# EAGLE design Preamplifier (EAGLE 9.5.1)
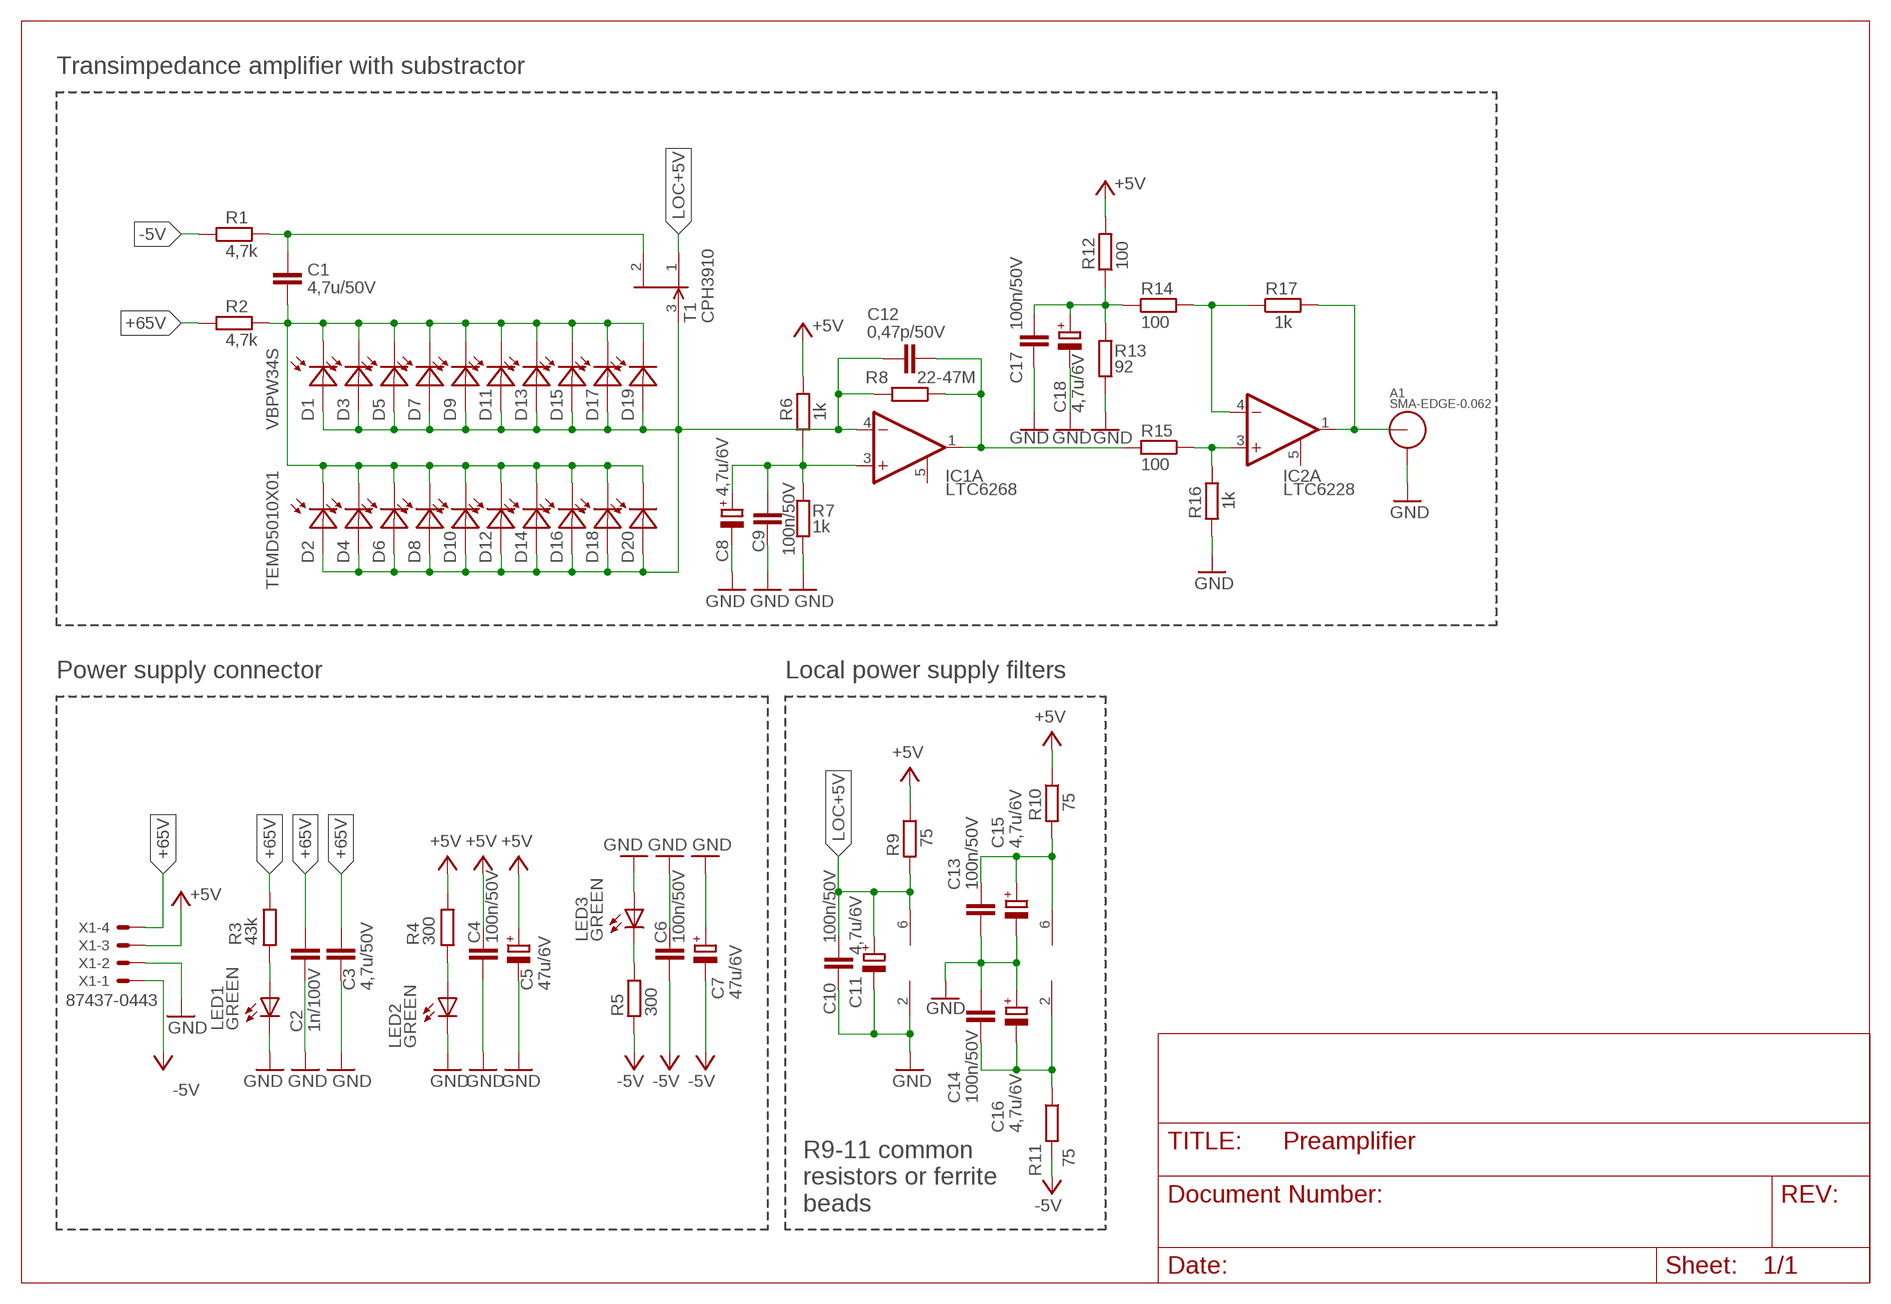
[diagram p0: schematic, sheet 1]

## Parts
A1  SMA-EDGE-0.062  LINX-SMA-EDGE-0.062  [CONSMA003.062]
C1  4,7u/50V  C-EUC1206  [C1206]
C2  1n/100V  C-EUC0603  [C0603]
C3  4,7u/50V  C-EUC1206  [C1206]
C4  100n/50V  C-EUC0603  [C0603]
C5  47u/6V  CPOL-EUSMCB  [SMC_B]
C6  100n/50V  C-EUC0603  [C0603]
C7  47u/6V  CPOL-EUSMCB  [SMC_B]
C8  4,7u/6V  CPOL-EUSMCA  [SMC_A]
C9  100n/50V  C-EUC0603  [C0603]
C10  100n/50V  C-EUC0603  [C0603]
C11  4,7u/6V  CPOL-EUSMCA  [SMC_A]
C12  0,47p/50V  C-EUC0603  [C0603]
C13  100n/50V  C-EUC0603  [C0603]
C14  100n/50V  C-EUC0603  [C0603]
C15  4,7u/6V  CPOL-EUSMCA  [SMC_A]
C16  4,7u/6V  CPOL-EUSMCA  [SMC_A]
C17  100n/50V  C-EUC0603  [C0603]
C18  4,7u/6V  CPOL-EUSMCA  [SMC_A]
D1  VBPW34S  [SOD6439X130N]
D2  TEMD5010X01  [DIODE_TEMD5010]
D3  VBPW34S  [SOD6439X130N]
D4  TEMD5010X01  [DIODE_TEMD5010]
D5  VBPW34S  [SOD6439X130N]
D6  TEMD5010X01  [DIODE_TEMD5010]
D7  VBPW34S  [SOD6439X130N]
D8  TEMD5010X01  [DIODE_TEMD5010]
D9  VBPW34S  [SOD6439X130N]
D10  TEMD5010X01  [DIODE_TEMD5010]
D11  VBPW34S  [SOD6439X130N]
D12  TEMD5010X01  [DIODE_TEMD5010]
D13  VBPW34S  [SOD6439X130N]
D14  TEMD5010X01  [DIODE_TEMD5010]
D15  VBPW34S  [SOD6439X130N]
D16  TEMD5010X01  [DIODE_TEMD5010]
D17  VBPW34S  [SOD6439X130N]
D18  TEMD5010X01  [DIODE_TEMD5010]
D19  VBPW34S  [SOD6439X130N]
D20  TEMD5010X01  [DIODE_TEMD5010]
IC1  LTC6268  [TSOT23-6]
IC2  LTC6228  LTC6268  [TSOT23-6]
LED1  GREEN  LEDCHIPLED_0603  [CHIPLED_0603]
LED2  GREEN  LEDCHIPLED_0603  [CHIPLED_0603]
LED3  GREEN  LEDCHIPLED_0603  [CHIPLED_0603]
R1  4,7k  R-EU_R0603  [R0603]
R2  4,7k  R-EU_R0603  [R0603]
R3  43k  R-EU_R0603  [R0603]
R4  300  R-EU_R0603  [R0603]
R5  300  R-EU_R0603  [R0603]
R6  1k  R-EU_R0603  [R0603]
R7  1k  R-EU_R0603  [R0603]
R8  22-47M  R-EU_R0603  [R0603]
R9  75  R-EU_R0603  [R0603]
R10  75  R-EU_R0603  [R0603]
R11  75  R-EU_R0603  [R0603]
R12  100  R-EU_R0603  [R0603]
R13  92  R-EU_R0603  [R0603]
R14  100  R-EU_R0603  [R0603]
R15  100  R-EU_R0603  [R0603]
R16  1k  R-EU_R0603  [R0603]
R17  1k  R-EU_R0603  [R0603]
T1  CPH3910  [SOT23]
X1  87437-0443  87438-0487437-0443  [87437-0443]

## Nets
+5V: C4.2 C5.+ R4.2 R6.2 R9.1 R10.1 R12.2 X1.3 X1.7
+65V: C2.2 C3.1 R2.1 R3.2 X1.4 X1.8
-5V: C6.1 C7.- R1.1 R5.1 R11.2 X1.1 X1.5
GND: A1.GND1 A1.GND2 A1.GND3 A1.GND4 C2.1 C3.2 C4.1 C5.- C6.2 C7.+ C8.- C9.1 C10.1 C11.- C13.1 C14.2 C15.- C16.+ C17.2 C18.- IC1.2(P:GND) LED1.C LED2.C LED3.A R7.1 R13.1 R16.2 X1.2 X1.6
LOC+5V: C10.2 C11.+ IC1.6(P:VDD) R9.2 T1.1(S)
N$1: IC2.3(A:+IN) R15.1 R16.1
N$2: C1.2 R1.2 T1.2(D)
N$3: C8.+ C9.2 IC1.3(A:+IN) R6.1 R7.2
N$4: C14.1 C16.- IC2.2(P:GND) R11.1
N$5: A1.ANT IC2.1(A:OUT) R17.2
N$7: C12.1 IC1.1(A:OUT) R8.1 R15.2
N$8: IC2.4(A:-IN) R14.2 R17.1
N$9: C17.1 C18.+ R12.1 R13.2 R14.1
N$27: LED1.A R3.1
N$29: LED2.A R4.1
N$30: LED3.C R5.2
N$38: C13.2 C15.+ IC2.6(P:VDD) R10.2
N$47: C12.2 D1.A D2.2(A) D3.A D4.2(A) D5.A D6.2(A) D7.A D8.2(A) D9.A D10.2(A) D11.A D12.2(A) D13.A D14.2(A) D15.A D16.2(A) D17.A D18.2(A) D19.A D20.2(A) IC1.4(A:-IN) R8.2 T1.3(G)
N$48: C1.1 D1.C D2.1(C) D3.C D4.1(C) D5.C D6.1(C) D7.C D8.1(C) D9.C D10.1(C) D11.C D12.1(C) D13.C D14.1(C) D15.C D16.1(C) D17.C D18.1(C) D19.C D20.1(C) R2.2
Unconnected: IC1.5(A:SHDN) IC2.5(A:SHDN)

## Notes on the sheet
- Transimpedance amplifier with substractor
- Power supply connector | Local power supply filters
- R9-11 common 
  resistors or ferrite 
  beads

## Library data of the parts
A1 = connector:LINX-SMA-EDGE-0.062: CONN SMA JACK 50 OHM EDGE MNT; DIGIKEY: CONSMA003.062-ND
C1 C2 = rcl:C-EU: CAPACITOR, European symbol
C3 C4 C6 C9 C10 C12-C14 C17 = rcl:C-EU: CAPACITOR, European symbol; SPICEPREFIX: C
C5 C7 C8 C11 C15 C16 C18 = rcl:CPOL-EU: POLARIZED CAPACITOR, European symbol; SPICEPREFIX: C
D1 D3 D5 D7 D9 D11 D13 D15 D17 D19 = VBPW34S:VBPW34S: VBPW34SR Series 60 V 940 nm 50 mA 215 mW Surface Mount Silicon PIN Photodiode; AVAILABILITY: Good; DESCRIPTION: VBPW34SR Series 60 V 940 nm 50 mA 215 mW Surface Mount Silicon PIN Photodiode; MF: Vishay; MP: VBPW34S; PACKAGE: SMD-2 Vishay; PRICE: 0.57 USD
D2 D4 D6 D8 D10 D12 D14 D16 D18 D20 = TEMD5010X01:TEMD5010X01; MANUFACTURER_PART_NUMBER: TEMD5010X01; VENDOR: Vishay
IC1 IC2 = LTC6268:LTC6268: LTC6268 - 500MHz Ultra-Low Bias Current FET Input Op Amp
LED1-LED3 = led:LED: LED OSRAM: - CHIPLED LG R971, LG N971, LY N971, LG Q971, LY Q971, LO R971, LY R971 LH N974, LH R974 LS Q976, LO Q976, LY Q976 LO Q996 - Hyper CHIPLED LW Q18S LB Q993, LB Q99A, LB R99A - SideLED LS A670, LO A670, LY A670, LG A670, LP A670 LB A673, LV A673, LT A673, LW A673 LH A674 LY A675 LS A676, LA A676, LO A676, LY A676, LW A676 LS A679, LY A679, LG A679 - Hyper Micro SIDELED® LS Y876, LA Y876, LO Y876, LY Y876 LT Y87S - SmartLED LW L88C, LW L88S LB L89C, LB L89S, LG L890 LS L89K, LO L89K, LY L89K LS L896, LA L896, LO L896, LY L896 - TOPLED LS T670, LO T670, LY T670, LG T670, LP T670 LSG T670, LSP T670, LSY T670, LOP T670, LYG T670 LG T671, LOG T671, LSG T671 LB T673, LV T673, LT T673, LW T673 LH T674 LS T676, LA T676, LO T676, LY T676, LB T676, LH T676, LSB T676, LW T676 LB T67C, LV T67C, LT T67C, LS T67K, LO T67K, LY T67K, LW E67C LS E67B, LA E67B, LO E67B, LY E67B, LB E67C, LV E67C, LT E67C LW T67C LS T679, LY T679, LG T679 LS T770, LO T770, LY T770, LG T770, LP T770 LB T773, LV T773, LT T773, LW T773 LH T774 LS E675, LA E675, LY E675, LS T675 LS T776, LA T776, LO T776, LY T776, LB T776 LHGB T686 LT T68C, LB T68C - Hyper Mini TOPLED® LB M676 - Mini TOPLED Santana® LG M470 LS M47K, LO M47K, LY M47K Source: http://www.osram.convergy.de LUXEON: - LUMILED® LXK2-PW12-R00, LXK2-PW12-S00, LXK2-PW14-U00, LXK2-PW14-V00 LXK2-PM12-R00, LXK2-PM12-S00, LXK2-PM14-U00 LXK2-PE12-Q00, LXK2-PE12-R00, LXK2-PE12-S00, LXK2-PE14-T00, LXK2-PE14-U00 LXK2-PB12-K00, LXK2-PB12-L00, LXK2-PB12-M00, LXK2-PB14-N00, LXK2-PB14-P00, LXK2-PB14-Q00 LXK2-PR12-L00, LXK2-PR12-M00, LXK2-PR14-Q00, LXK2-PR14-R00 LXK2-PD12-Q00, LXK2-PD12-R00, LXK2-PD12-S00 LXK2-PH12-R00, LXK2-PH12-S00 LXK2-PL12-P00, LXK2-PL12-Q00, LXK2-PL12-R00 Source: www.luxeon.com KINGBRIGHT: KA-3528ASYC Source: www.kingbright.com
R1-R17 = rcl:R-EU_: RESISTOR, European symbol; SPICEPREFIX: R
T1 = CPH3910:CPH3910: Silicon n-channel symmetric junction field effect transistor; AVAILABILITY: In production; DESCRIPTION: Trans JFET N-CH 20V 40mA Si 3-Pin TO-236AB; MF: ON Semiconductors; MP: CPH3910; PACKAGE: None; PRICE: None
X1 = con-molex:87438-04: Wire-to-Board 1.50mm (.059") Pitch Header - Right Angle, SMT, Shrouded Source: http://www.molex.com/product/micro/87438.html

## Board
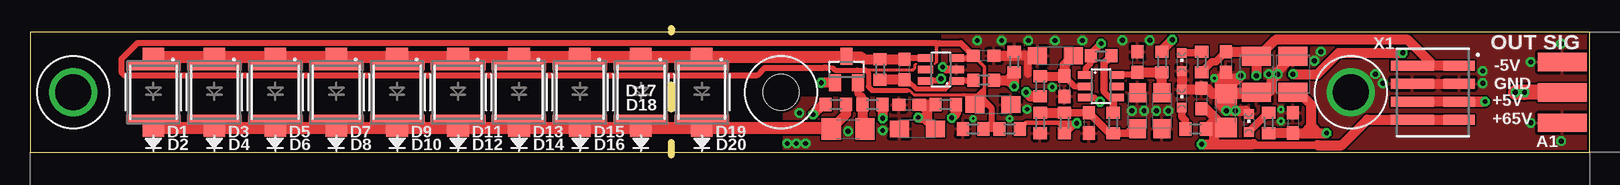
[diagram p1: board, top side]
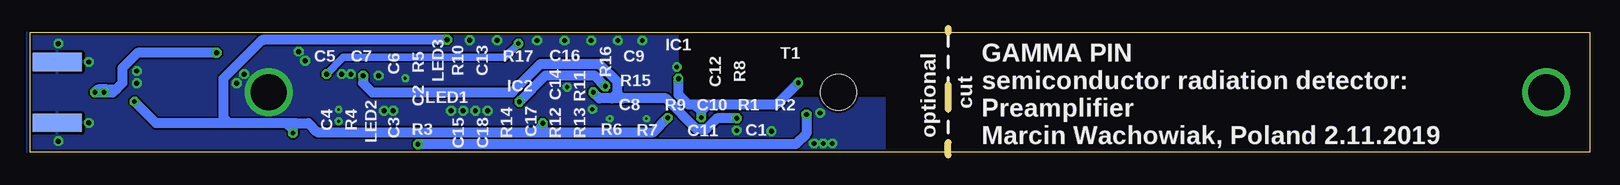
[diagram p2: board, bottom side, seen from below]

Size 130 x 10 mm. Coordinates in mm from the lower left corner, seen from the top.
Outline: 0,0 130,0 130,10 0,10 0,0
Copper layers (1*16): Top 0.035mm / dielectric 1.5mm / Bottom 0.035mm
Design rules "default *": minimum track width 6mil, minimum drill 0.2mm, track to track 6mil, track to pad 6mil, pad to pad 6mil, via to via 6mil, smd to smd 6mil, copper to edge 8mil, drill to drill 6mil, minimum pad ring 10mil, minimum via ring 8mil, stop-mask expansion 4mil, vias tented up to drill 20mil, thermal gap 10mil
Holes 3 mm at 62.61,5.01
Milling: 3 lines

### Footprints (pad centres in the part's own frame; a part is rotated, then mirrored left to right if it is on the bottom)
CONSMA003.062 = smd 4.06 x 1.52: ANT 0,0; GND1 0,2.54; GND2 0,-2.54 | smd 4.06 x 1.52 bottom: GND3 0,2.54; GND4 0,-2.54
C1206 = smd 1.6 x 1.8: 1 -1.4,0; 2 1.4,0
C0603 = smd 1.1 x 1: 1 -0.85,0; 2 0.85,0
SMC_B = smd 1.6 x 2.4: + -1.5,0; - 1.5,0
SMC_A = smd 1.6 x 1.4: + -1.5,0; - 1.5,0
SOD6439X130N = smd 1.5 x 1.8: A 2.95,0; C -2.95,0
DIODE_TEMD5010 = smd 0.749 x 4.547: 1 -2.229,0; 2 2.229,0
TSOT23-6 = smd 0.62 x 1.22: 1 -0.95,-1.3; 2 0,-1.3; 3 0.95,-1.3; 4 0.95,1.3; 5 0,1.3; 6 -0.95,1.3
CHIPLED_0603 = smd 0.8 x 0.8: A 0,-0.75; C 0,0.75
R0603 = smd 1 x 1.1: 1 -0.85,0; 2 0.85,0
SOT23 = smd 1 x 1.4: 1 -0.95,-1.1; 2 0.95,-1.1; 3 0,1.1
87437-0443 = smd 2.65 x 0.85: 1 0,2.25; 2 0,0.75; 3 0,-0.75; 4 0,-2.25 | smd 3.55 x 0.85: 5 -3.9,2.25; 6 -3.9,0.75; 7 -3.9,-0.75; 8 -3.9,-2.25

### Placement (x,y rotation side)
A1  127.73,5.01 0 top
C1  68.2,1.96 0 top
C2  97.66,4.5 270 top
C3  99.69,3.48 90 top
C4  105.28,2.47 270 top
C5  105.28,6.53 90 top
C6  99.69,7.55 270 top
C7  102.24,6.53 90 top
C8  80.26,3.99 0 top
C9  79.5,8.05 180 top
C10  73.28,3.99 0 top
C11  73.98,1.96 180 top
C12  72.9,6.91 90 top
C13  92.33,7.55 270 top
C14  86.23,5.51 270 top
C15  94.36,3.48 270 top
C16  85.47,8.05 0 top
C17  88.26,2.47 270 top
C18  92.33,3.48 90 top
D1  10.29,5.01 90 top
D2  10.29,5.01 90 top
D3  15.37,5.01 90 top
D4  15.37,5.01 90 top
D5  20.45,5.01 90 top
D6  20.45,5.01 90 top
D7  25.53,5.01 90 top
D8  25.53,5.01 90 top
D9  30.61,5.01 90 top
D10  30.61,5.01 90 top
D11  35.69,5.01 90 top
D12  35.69,5.01 90 top
D13  40.77,5.01 90 top
D14  40.77,5.01 90 top
D15  45.85,5.01 90 top
D16  45.85,5.01 90 top
D17  50.93,5.01 90 top
D18  50.93,5.01 90 top
D19  56.01,5.01 90 top
D20  56.01,5.01 90 top
IC1  75.95,6.91 90 top
IC2  89.28,5.51 270 top
LED1  96.01,4.5 0 top
LED2  101.6,2.47 0 top
LED3  96.01,7.55 0 top
R1  70.23,3.99 180 top
R2  67.18,3.99 0 top
R3  97.16,1.96 0 top
R4  103.25,2.47 270 top
R5  97.66,7.55 90 top
R6  81.66,1.96 0 top
R7  78.61,1.96 0 top
R8  70.87,6.91 90 top
R9  76.33,3.99 180 top
R10  94.36,7.55 270 top
R11  84.2,5.51 270 top
R12  86.23,2.47 270 top
R13  84.2,2.47 90 top
R14  90.3,2.47 90 top
R15  79.5,6.02 180 top
R16  82.04,7.55 90 top
R17  89.28,8.05 180 top
T1  68.07,6.91 0 top
X1  119.13,4.99 0 top

### Tracks (layer width: path | path; a pad name or v marks a point on that pad's centre or on a via)
+5V  (via drill 0.4)
  Top 0.356: R6.2 83.02,2.47 85.72,2.47 | 85.98,2.47 85.72,2.47 | v87.25,2.44 87.22,2.47 87.08,2.47 | 86.23,2.21 86.23,2.47 | v87.25,2.44 86.43,1.62 R12.2 | R12.2 85.98,1.87 85.98,2.47 | 85.98,2.47 87.08,2.47 | R12.2 86.66,2.04 | 86.66,2.04 87.08,2.47 | v87.25,2.44 86.49,2.44 | 86.49,2.44 86.46,2.44 86.23,2.21 | R12.2 86.23,2.21 | 86.49,2.44 86.49,2.21 86.66,2.04 | R12.2 86.23,1.96 85.72,2.47
  Top 0.813: R9.1 77.18,3.23 v76.84,2.89 | v76.84,2.89 v76.84,2.88 | C4.2 R4.2 | C4.2 106.21,1.62 106.81,2.21 | 106.81,2.21 106.81,3.99 105.77,5.03 C5.+ | C4.2 107.4,1.62 | 106.81,2.21 107.4,1.62 | 107.4,1.62 v108.08,1.62 | v76.84,2.88 v76.84,2.89 | v95.22,9.39 94.36,8.53 R10.1 | X1.7 121.22,4.24 v121.28,4.24 X1.3
  Bottom 0.813: 107.85,2.44 108.59,2.44 | 108.59,2.44 113.41,2.44 | 113.41,2.44 114.17,2.44 | 114.17,2.44 119.48,2.44 v121.28,4.24 | 108.59,2.44 108.08,1.93 v108.08,1.62 108.08,2.21 107.85,2.44 | 87.76,1.7 78.01,1.7 v76.84,2.88 | v87.25,2.44 87.25,2.21 87.76,1.7 | 87.76,1.7 106.04,1.7 106.78,2.44 107.85,2.44 | 114.17,2.44 113.87,2.75 113.87,2.89 | 113.87,2.89 113.87,6.17 110.64,9.39 110.52,9.39 | v95.22,9.39 110.52,9.39 | 110.52,9.39 110.58,9.39 | 113.87,2.89 113.41,2.44
+65V  (via drill 0.4)
  Top 0.203: 107.31,0.61
  Top 0.61: 107.31,0.61 102.06,0.61 101.98,0.69
  Top 0.813: 98.43,1.96 R3.2 98.68,2.63 | 98.43,1.96 99.57,1.96 C3.1 99.44,2.08 | 99.44,2.08 99.23,2.08 | 98.93,0.69 98.68,0.94 98.68,1.7 | 98.68,1.7 98.43,1.96 | C2.2 98,3.65 98.68,2.97 | 98.68,2.63 98.68,1.7 | 98.68,2.97 98.68,2.63 | 98.68,2.97 99.44,2.21 99.44,2.08 | v65.28,3.16 66.1,3.99 R2.1 | v97.66,0.69 98.93,0.69 | 98.93,0.69 101.98,0.69 | 107.31,0.61 109.34,0.61 111.47,2.74 X1.8 X1.4
  Bottom 0.813: v65.28,3.16 65.28,1.58 66.17,0.69 v97.66,0.69
-5V  (via drill 0.4)
  Top 0.61: R1.1 70.99,3.9 | C6.1 98.84,7.55 98.51,7.55 R5.1 | C7.- 102.24,7.29
  Top 0.813: 71.1,3.97 R1.1 v71.08,2.85 | C6.1 101.13,8.4 101.5,8.03 C7.- 102.51,8.31 102.74,8.31 103.82,9.39 114.87,9.39 117.02,7.24 | v83.04,5.01 83.39,4.66 R11.2 | 102.24,7.29 v102.24,6.4 | X1.1 117.47,7.24 117.02,7.24 | 117.02,7.24 X1.5
  Bottom 0.813: v71.08,2.85 72.74,2.85 73.64,1.94 74.44,1.94 76.99,4.5 80.65,4.5 | v83.04,5.01 82.53,4.5 81.51,4.5 | 80.65,4.5 81.51,4.5 | v102.24,6.4 102.24,5.77 101.47,5.01 89.8,5.01 87.42,7.38 82.55,7.38 81.08,5.91 81.08,4.93 | 81.08,4.93 80.65,4.5 | 81.08,4.93 81.51,4.5
GND  (via drill 0.2, 0.25, 0.35, 0.4, 3)
  Top 0.61: 83.19,8.05 83.19,6.53 | IC1.2 76.4,6.91 76.3,7.01 76.19,7.01 v76.07,7.12
  Top 0.813: C7.+ 99.84,5.03 C3.2 C6.2 | C7.+ 102.08,4.88 98.55,4.88 98.08,5.35 C2.1 97.56,5.25 LED1.C LED3.A | 105.26,8.03 C5.- 103.76,6.51 103.76,6.3 | C9.1 82.38,8.05 | 82.38,8.05 83.19,8.05 C16.+ | 82.38,8.05 R16.2 | C7.+ 103.28,5.03 103.52,5.28 103.52,6.06 103.76,6.3 | 103.76,6.3 v104.01,6.53 | LED2.C 101.33,3.48 100.2,3.48 100.2,5.67 v100.93,6.4 100.71,6.18 99.19,6.18 99.19,4.02 v99.73,3.48 | X1.6 X1.2
  other vias: 110.11,5.01 112.78,5.77 80.99,9.32 85.44,9.32 83.22,9.32 107.6,8.4 104.27,2.59 91.06,9.36 83.12,3.61 85.22,5.45 94.9,3.48 91.85,3.48 107.06,7.64 125.09,7.55 125.09,2.47 127.63,9.07 127.63,0.94 71.09,1.83 68.2,1.77 98.71,6.18 100.49,3.48 63.12,0.75 63.88,0.75 64.64,0.75 64.13,3.29 93.88,3.48 92.87,3.48 87.73,9.32 78.96,9.32 93.34,9.36 81.66,2.82 104.27,3.58 103.25,6.53 78.61,2.82 121.09,6.78 112.14,6.53 121.09,5.77
  pour Bottom: 0,0 130.23,0 130.23,10 0,10
  pour Top: 0,0 130.1,0 130.1,10 0,10
LOC+5V  (via drill 0.4)
  Top 0.508: v75.95,6.15 75.76,5.96 IC1.6
  Top 0.813: 74.8,3.99 C10.2 74.3,3.99 74.8,3.48 | 74.8,3.99 R9.2 | T1.1 v65.96,5.81 | 74.8,3.48 74.8,3.99 | C11.+ 74.8,2.63 | 74.8,2.63 74.8,3.48 | v74.04,2.91 74.53,2.91 74.8,2.63
  Bottom 0.813: v65.96,5.81 67.78,3.99 73.53,3.99 | v75.95,6.15 75.95,4.82 75.12,3.99 74.55,3.99 | 73.53,3.99 74.04,3.99 | 74.04,3.99 74.55,3.99 | v74.04,2.91 74.04,3.48 | 74.04,3.48 74.04,3.99 | 74.04,3.48 74.55,3.99 | 74.04,3.48 73.53,3.99
N$1  (via drill 0.4)
  Top 0.508: IC2.3 88.75,4.56 v89.21,4.23
  Top 0.813: R15.1 81.53,6.02 | 81.53,6.02 82.04,6.53 | 82.04,6.53 R16.1 | 81.53,6.02 v82.04,5.51 82.04,6.53
  Bottom 0.813: v89.21,4.23 87.02,6.42 82.95,6.42 v82.04,5.51
N$2
  Top 0.61: T1.2 69.02,4.94 69.38,4.59 R1.2
  Top 0.813: 68.96,5.75 T1.2 | R1.2 69.38,2.81 69.72,2.47 69.72,2.08 C1.2
N$3
  Top 0.152: 79.02,4.82 78.76,4.56 C8.+ 78.76,4.69 | 78.76,4.69 79.18,4.69 | 78.76,4.69 77.98,4.69 77.85,4.82 | 73.76,7.29 73.78,7.29 73.87,7.38 | 75.56,7.57 75.49,7.5 75.49,7.46 75.41,7.39
  Top 0.203: 75.56,9.12 75.56,8.82 | 75.56,8.82 75.26,9.12 75.06,9.12 | 75.56,8.82 75.82,9.07 75.82,9.12 | 75.56,7.58 75.51,7.52
  Top 0.246: 78.61,3.99 C8.+ | 73.13,5.15 73.35,5.15 73.69,4.82 77.85,4.82 79.02,4.82 79.04,4.84
  Top 0.254: 73.76,7.29 73.76,7.04 73.61,6.89 68.98,6.89 68.96,6.87
  Top 0.305: 80.14,2.97 80.14,3.74 | C9.2 79.55,7.16 79.55,5.35 | 80.14,1.96 80.26,2.08 | 78.66,3.99 C8.+ 79.29,4.52 79.29,5.09 | 79.04,4.84 79.29,5.09 | 79.29,5.09 79.55,5.35 | 79.55,5.35 79.55,4.33 79.88,3.99 | 75.56,9.12 75.56,7.58 75.56,7.57
  Top 0.406: 66.42,7.04 66.93,7.04 67.1,6.87 68.96,6.87 69.67,6.87 69.88,6.66 69.88,5.5 70.22,5.15 73.13,5.15 | 78.6,3.99 C8.+
  Top 0.508: IC1.3 78.1,7.86 78.3,8.05 C9.2 77.59,9.12 75.82,9.12 75.56,9.12 75.06,9.12 8.95,9.12 7.61,7.78 7.61,6.69 7.84,6.45 60.64,6.45 61.23,7.04 66.16,7.04 | R7.2 79.63,1.96 | 79.63,1.96 80.14,1.96 R6.1 | 79.88,3.99 80.14,3.74 80.14,2.47 79.63,1.96 | 79.88,3.99 C8.+ | 66.42,7.04 66.16,7.04 | 66.16,7.04 66.17,7.04 | 79.18,4.69 79.88,3.99
N$4
  Top 0.508: C14.1 87.08,5.51 IC2.2
  Top 0.762: R11.1 C14.1
  Top 0.813: C16.- 86.23,7.32 C14.1
N$5  (via drill 0.4)
  Top 0.508: R17.2 88.43,7.44 87.98,6.99 IC2.1
  Top 0.61: R17.2 88.43,8.22 v89.29,9.08
  Top 0.813: v105.28,6.53 107.31,6.53 109.09,8.31 v114.43,8.31
  Top 1.27: A1.ANT v124.59,5.01 v123.82,5.01
  Bottom 0.61: v89.29,9.08 90.44,7.93 103.89,7.93 v105.28,6.53
  Bottom 0.813: 123.57,5.26 124.33,5.26 v124.59,5.01 | 123.57,5.26 v123.82,5.01 v124.59,5.01 | v114.43,8.31 121.03,8.31 122.3,7.04 122.3,5.77 122.81,5.26 | v124.59,5.01 123.06,5.01 122.81,5.26 | 123.57,5.26 122.81,5.26
N$6  (via drill 3)
  other vias: 3.61,5.01
N$7
  Top 0.305: R8.1 73.19,6.06
  Top 0.406: R8.1 73.12,6.06 73.89,5.29 76.29,5.29 76.96,5.96 78.1,5.96
  Top 0.508: R15.2 78.59,5.96 78.1,5.96 IC1.1 77.01,5.96
  Top 0.813: C12.1 R8.1
N$8
  Top 0.508: 89.51,5.27 89.51,5.07 90.3,4.29 90.3,4.28 | IC2.4 90.3,4.28 | 90.3,4.28 90.3,4.23
  Top 0.61: 90.3,4.23 R14.2 | 89.51,5.27 89.51,7.44 R17.1
N$9
  Top 0.61: 91.48,1.62 91.84,1.98 C18.+ 91.96,1.62 R14.1 89.97,1.62 C17.1 R12.1
  Top 0.813: R13.2 R12.1
N$10
  cutout Top: -0.63,11.36 75.82,11.36 75.82,4.75 62.61,4.75 62.61,-2.11 -0.63,-2.11
  cutout Bottom: -1.78,11.36 75.82,11.36 75.82,4.75 58.55,4.75 58.55,-2.11 -1.78,-2.11
N$27
  Top 0.61: R3.1 96.31,2.68 96.01,2.97 LED1.A
N$29
  Top 0.61: 103.15,3.22 103.21,3.27 | 103.21,3.27 R4.1 | 101.65,1.72 LED2.A 103.16,3.27 103.21,3.27
N$30
  Top 0.61: LED3.C 97.56,8.3 R5.2
N$38
  Top 0.508: IC2.6 91.82,6.46 92.05,6.7 C13.2
  Top 0.813: C13.2 93.85,6.7 | 93.85,6.7 R10.2 | C15.+ 94.36,6.19 93.85,6.7
N$47
  Top 0.508: D1.A D2.2 | D3.A D4.2 | D5.A D6.2 | D7.A D8.2 | D9.A D10.2 | D11.A D12.2 | D13.A D14.2 | D15.A D16.2 | D17.A D18.2 | D19.A D20.2 | IC1.4 73,7.86 R8.2
  Top 0.813: R8.2 C12.2 69.51,7.76 69.26,8.01 T1.3
  Top 1.016: D1.A D3.A D5.A D7.A D9.A D11.A D13.A D15.A D17.A D19.A 68.02,7.96 T1.3
N$48
  Top 0.508: D1.C D2.1 | D3.C D4.1 | D5.C D6.1 | D7.C D8.1 | D9.C D10.1 | D11.C D12.1 | D13.C D14.1 | D15.C D16.1 | D19.C D20.1 | D17.C D18.1
  Top 0.813: C1.1 68.03,3.19 R2.2
  Top 1.016: D1.C D3.C D5.C D7.C D9.C D11.C D13.C D15.C D17.C D19.C 66.07,2.06 66.42,1.7 66.55,1.7 C1.1

### Text on the board
tNames: OUT SIG | -5V | GND | +5V | +65V
bNames: cut | optional | GAMMA PIN / semiconductor radiation detector: / Preamplifier / Marcin Wachowiak, Poland 2.11.2019